# EAGLE design cinamin (EAGLE 6.6.0)
AUTHOR: Joshua Adkins; REV: A; REVISION: A
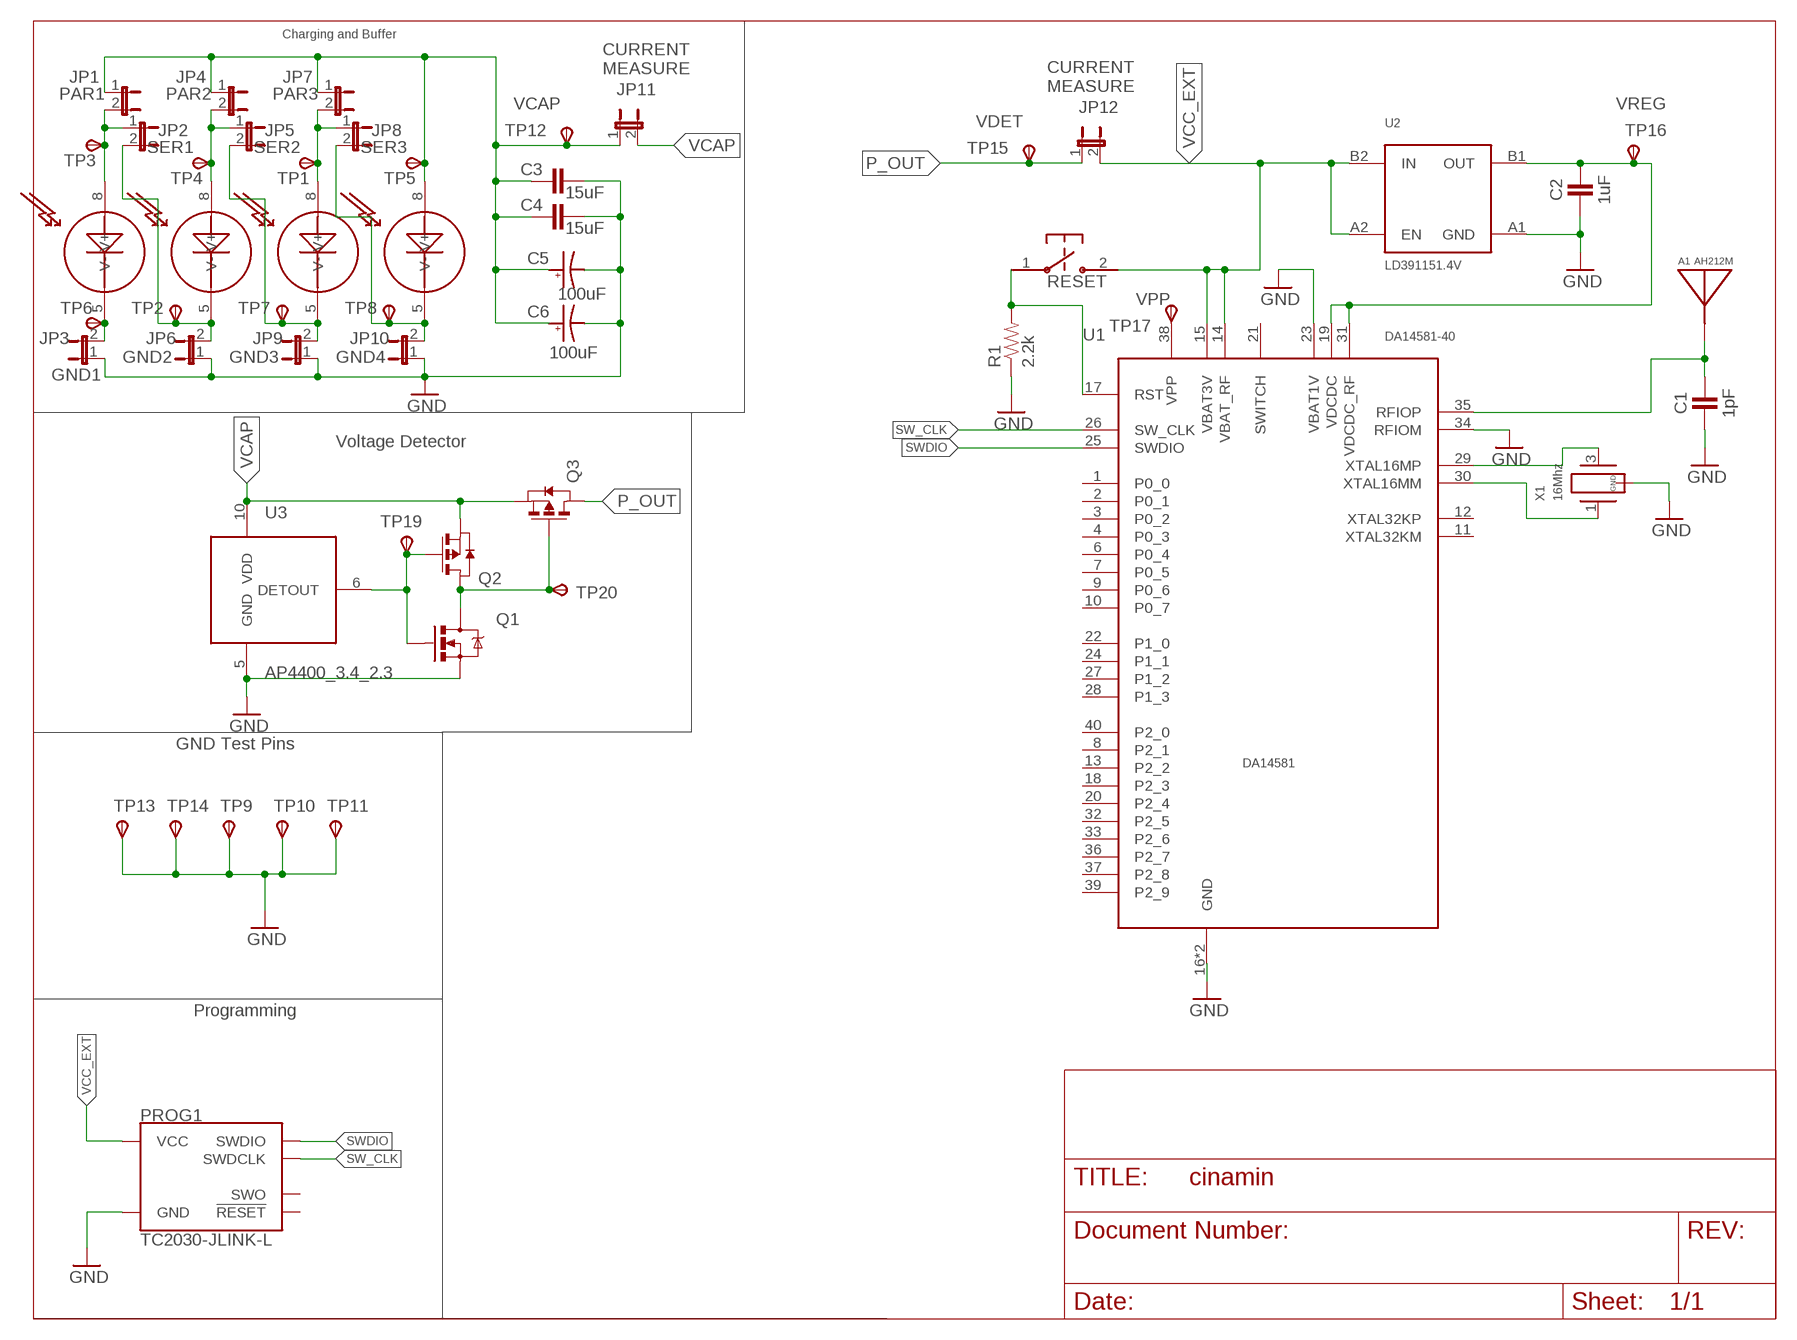
[diagram p0: schematic, sheet 1]

## Parts
A1  AH212M  [AH212M]
C1  1pF  CAPACITOR  [0402_CAP]
C2  1uF  CAPACITOR  [0402_CAP]
C3  15uF  CAPACITOR  [0402_CAP]
C4  15uF  CAPACITOR  [0402_CAP]
C5  100uF  CAP_POL0603  [CAP0603]
C6  100uF  CAP_POL0603  [CAP0603]
D1  CPC1822  [SOIC-8]
D2  CPC1822  [SOIC-8]
D3  CPC1822  [SOIC-8]
D4  CPC1822  [SOIC-8]
JP1  PAR1  JUMPER-2PTH  [1X02]
JP2  SER1  JUMPER-2PTH  [1X02]
JP3  GND1  JUMPER-2PTH  [1X02]
JP4  PAR2  JUMPER-2PTH  [1X02]
JP5  SER2  JUMPER-2PTH  [1X02]
JP6  GND2  JUMPER-2PTH  [1X02]
JP7  PAR3  JUMPER-2PTH  [1X02]
JP8  SER3  JUMPER-2PTH  [1X02]
JP9  GND3  JUMPER-2PTH  [1X02]
JP10  GND4  JUMPER-2PTH  [1X02]
JP11  CURRENT_MEASURE1  JUMPER-2PTH  [1X02]
JP12  CURRENT_MEASURE2  JUMPER-2PTH  [1X02]
PROG1  TC2030-JLINK-L  [TC2030-IDC]
Q1  MOSFET-NCHANNELXFDN-3  [XFDFN-3]
Q2  MOSFET-PCHANNEL  [XFDFN-3]
Q3  MOSFET-PCHANNEL  [XFDFN-3]
R1  2.2k  RESISTOR0402_RES  [0402_RES]
RESET  B3U-1000P  [B3U-1000P]
TP1  D3H  TPSPAD1-13  [P1-13]
TP2  D2L  TPSPAD1-13  [P1-13]
TP3  D1H  TPSPAD1-13  [P1-13]
TP4  D2H  TPSPAD1-13  [P1-13]
TP5  D4H  TPSPAD1-13  [P1-13]
TP6  D1L  TPSPAD1-13  [P1-13]
TP7  D3L  TPSPAD1-13  [P1-13]
TP8  D4L  TPSPAD1-13  [P1-13]
TP9  GND  TPSPAD1-13  [P1-13]
TP10  GND  TPSPAD1-13  [P1-13]
TP11  GND  TPSPAD1-13  [P1-13]
TP12  VCAP  TPSPAD1-13  [P1-13]
TP13  GND  TPSPAD1-13  [P1-13]
TP14  GND  TPSPAD1-13  [P1-13]
TP15  VDET  TPSPAD1-13  [P1-13]
TP16  VREG  TPSPAD1-13  [P1-13]
TP17  VPP  TPSPAD1-13  [P1-13]
TP19  VCAP  TPSPAD1-13  [P1-13]
TP20  VCAP  TPSPAD1-13  [P1-13]
U1  DA14581-40  [QFN-40-5MM]
U2  LD391151.4V  [FLIP_CHIP-4]
U3  AP4400_3.4_2.3  AP4400  [TSOP-10]
X1  16Mhz  TXC-8Y  [TXC-8Y]

## Nets
DET_OUT: Q1.G Q2.G TP19.TP(PP) U3.6(DETOUT)
GND: C1.2 C2.2 C3.2 C4.2 C5.NEG(ANODE) C6.NEG(ANODE) JP3.1 JP6.1 JP9.1 JP10.1 PROG1.5(GND) Q1.S R1.1 TP9.TP(PP) TP10.TP(PP) TP11.TP(PP) TP13.TP(PP) TP14.TP(PP) U1.16(GND) U1.23(VBAT1V) U1.34(RFIOM) U1.PAD(GND) U2.A1(GND) U3.5(GND) X1.2(GND) X1.4(GND)
JP10: D4.5(V-) JP8.2 JP10.2 TP8.TP(PP)
N$1: C3.1 C4.1 C5.POS(CATHODE) C6.POS(CATHODE) D4.8(V+) JP1.1 JP4.1 JP7.1 JP11.1 TP5.TP(PP) TP12.TP(PP)
N$2: TP17.TP(PP) U1.38(VPP)
N$3: C2.1 TP16.TP(PP) U1.19(VDCDC) U1.31(VDCDC_RF) U2.B1(OUT)
N$4: Q1.D Q2.D Q3.G TP20.TP(PP)
N$15: U1.29(XTAL16MP) X1.3
N$18: U1.30(XTAL16MM) X1.1
N$19: A1.P1(ANTENNA) C1.1 U1.35(RFIOP)
N$22: R1.2 RESET.1 U1.17(RST)
N$61: D1.5(V-) JP3.2 TP6.TP(PP)
N$62: D2.5(V-) JP2.2 JP6.2 TP2.TP(PP)
N$63: D3.5(V-) JP5.2 JP9.2 TP7.TP(PP)
N$65: D1.8(V+) JP1.2 JP2.1 TP3.TP(PP)
N$67: D2.8(V+) JP4.2 JP5.1 TP4.TP(PP)
N$68: D3.8(V+) JP7.2 JP8.1 TP1.TP(PP)
P_OUT: JP12.1 Q3.D TP15.TP(PP)
SW_CLK: PROG1.4(SWDCLK) U1.26(SW_CLK)
SWDIO: PROG1.2(SWDIO) U1.25(SWDIO)
VCAP: JP11.2 Q2.S Q3.S U3.10(VDD)
VCC_EXT: JP12.2 PROG1.1(VCC) RESET.2 U1.14(VBAT_RF) U1.15(VBAT3V) U2.A2(EN) U2.B2(IN)
Unconnected: PROG1.3(!RESET) PROG1.6(SWO) U1.1(P0_0) U1.2(P0_1) U1.3(P0_2) U1.4(P0_3) U1.6(P0_4) U1.7(P0_5) U1.8(P2_1) U1.9(P0_6) U1.10(P0_7) U1.11(XTAL32KM) U1.12(XTAL32KP) U1.13(P2_2) U1.18(P2_3) U1.20(P2_4) U1.21(SWITCH) U1.22(P1_0) U1.24(P1_1) U1.27(P1_2) U1.28(P1_3) U1.32(P2_5) U1.33(P2_6) U1.36(P2_7) U1.37(P2_8) U1.39(P2_9) U1.40(P2_0)

## Notes on the sheet
- Charging and Buffer
- CURRENT
  MEASURE
- CURRENT
  MEASURE
- VCAP | VREG
- VDET
- VPP
- Voltage Detector
- GND Test Pins
- Programming

## Library data of the parts
A1 = chips:AH212M: Small 2.4Ghz chip antenna; DIGIKEY: 587-2725-1-ND
C1-C4 = passives:CAPACITOR: 0402 Capacitor
C5 C6 = passives:CAP_POL
D1-D4 = chips:CPC1822: SOIC Solar Cell; DIGIKEY: CLA289-ND
JP1-JP12 = SparkFun-Passives:JUMPER-2: Jumper Basic 0.1" spaced jumper. Use with breakaway headers.
PROG1 = connector:TC2030-JLINK
Q1 = fets:MOSFET-NCHANNEL: Generic NMOS footprint; DIGIKEY: DMN2400UFB4-7DICT-ND
Q2 Q3 = fets:MOSFET-PCHANNEL: small package Pchannel fet; DIGIKEY: DMP21D5UFB4-7BDICT-ND
R1 = passives:RESISTOR: Resistor Basic schematic elements and footprints for 0603, 1206, and PTH resistors.
RESET = switches:B3U: Switch; DIGIKEY: SW1020CT-ND
TP1-TP17 TP19 TP20 = testpad:TPS: TEST PIN
U1 = chips:DA14581-40: A better version of the DA14580 - faster boot; DIGIKEY: 1564-1016-1-ND
U2 = chips:LD39115: Small, low current LDO STMICRO; DIGIKEY: 497-15591-2-ND
U3 = chips:AP4400: Ultra Low Power Voltage Detector with Hysterisis; DIGIKEY: CANT_BUY
X1 = crystals:TXC-8Y: 2mmx1.6mm SMD Crystal

## Board
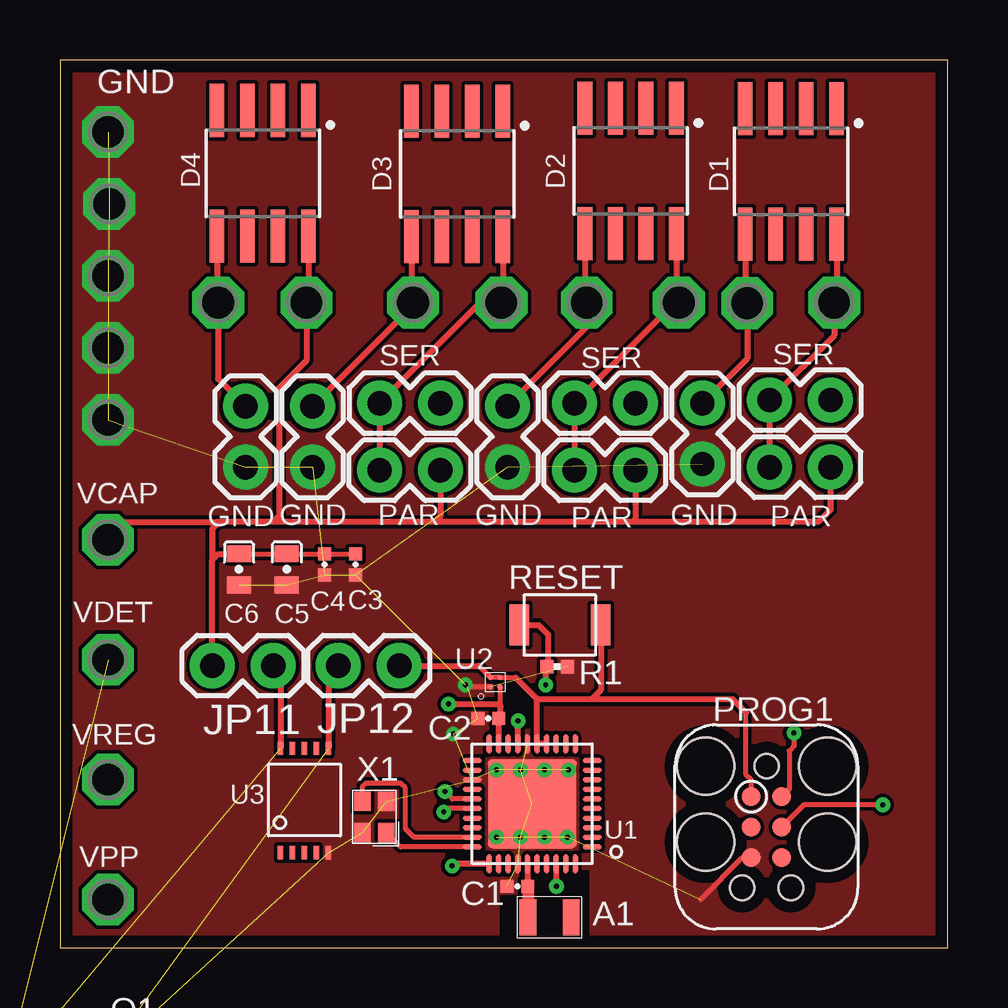
[diagram p1: board, top side]
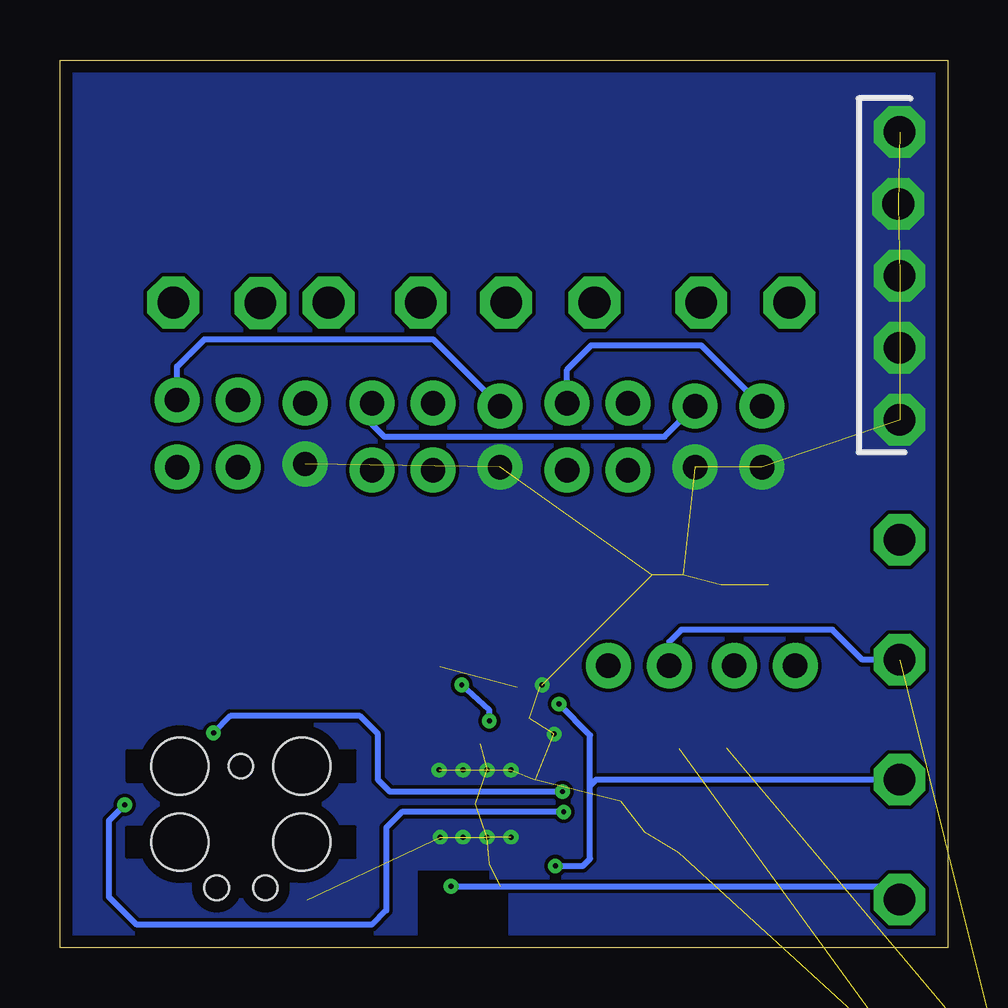
[diagram p2: board, bottom side, seen from below]

Size 37 x 37 mm. Coordinates in mm from the lower left corner, seen from the top.
Outline: 0,0 37,0 37,37 0,37 0,0
Copper layers (1*16): Top 0.0178mm / dielectric 59mil / Bottom 0.0178mm
Design rules "sunstone-2lyr_v1.0.0.3": minimum track width 6mil, minimum drill 14mil, track to track 6mil, track to pad 6mil, pad to pad 6mil, via to via 6mil, smd to smd 6mil, copper to edge 20mil, drill to drill 16mil, minimum pad ring 8mil, minimum via ring 8mil, stop-mask expansion 3mil, vias tented up to drill 50mil, thermal gap 10mil

### Footprints (pad centres in the part's own frame; a part is rotated, then mirrored left to right if it is on the bottom)
AH212M = smd 1.5 x 0.7: P1 0,0.35; P2 0,2.15
0402_CAP = smd 0.536 x 0.546: 1 -0.433,0; 2 0.433,0
CAP0603 = smd 0.7 x 1: NEG 0.65,0; POS -0.65,0
SOIC-8 = smd 0.61 x 2.21: 1 -1.905,-2.616; 2 -0.635,-2.616; 3 0.635,-2.616; 4 1.905,-2.616; 5 1.905,2.616; 6 0.635,2.616; 7 -0.635,2.616; 8 -1.905,2.616
1X02 = drill 1.016 pad 1.88: 1 0,0; 2 2.54,0
TC2030-IDC = smd 0.787 x 0.787: 1 -1.27,-0.635; 2 -1.27,0.635; 3 0,-0.635; 4 0,0.635; 5 1.27,-0.635; 6 1.27,0.635 | hole 2.375: -2.54,2.54; 0.635,2.54; 0.635,-2.54; -2.54,-2.54 | hole 1.016: -2.54,0; 2.54,1.016; 2.54,-1.016
XFDFN-3 = smd 0.4 x 0.7: D 0.35,0 | smd 0.4 x 0.25: G -0.35,0.215; S -0.35,-0.215
0402_RES = smd 0.536 x 0.546: 1 -0.433,0; 2 0.433,0
B3U-1000P = smd 0.8 x 1.7: 1 -1.7,0; 2 1.7,0
P1-13 = drill 1.321 pad 2.159 octagon: TP 0,0
QFN-40-5MM = smd 0.8 x 0.2: 1 -2.5,1.8; 2 -2.5,1.4; 3 -2.5,1; 4 -2.5,0.6; 5 -2.5,0.2; 6 -2.5,-0.2; 7 -2.5,-0.6; 8 -2.5,-1; 9 -2.5,-1.4; 10 -2.5,-1.8; 21 2.5,-1.8; 22 2.5,-1.4; 23 2.5,-1; 24 2.5,-0.6; 25 2.5,-0.2; 26 2.5,0.2; 27 2.5,0.6; 28 2.5,1; 29 2.5,1.4; 30 2.5,1.8 | smd 0.2 x 0.8: 11 -1.8,-2.5; 12 -1.4,-2.5; 13 -1,-2.5; 14 -0.6,-2.5; 15 -0.2,-2.5; 16 0.2,-2.5; 17 0.6,-2.5; 18 1,-2.5; 19 1.4,-2.5; 20 1.8,-2.5; 31 1.8,2.5; 32 1.4,2.5; 33 1,2.5; 34 0.6,2.5; 35 0.2,2.5; 36 -0.2,2.5; 37 -0.6,2.5; 38 -1,2.5; 39 -1.4,2.5; 40 -1.8,2.5 | smd 3.7 x 3.7: PAD 0,0
FLIP_CHIP-4 = smd 0.22 x 0.22: A1 -0.2,-0.2; A2 -0.2,0.2; B1 0.2,-0.2; B2 0.2,0.2
TSOP-10 = smd 0.22 x 0.55: 1 -1,-2.2; 2 -0.5,-2.2; 3 0,-2.2; 4 0.5,-2.2; 5 1,-2.2; 6 1,2.15; 7 0.5,2.15; 8 0,2.15; 9 -0.5,2.15; 10 -1,2.15
TXC-8Y = smd 0.8 x 0.7: 1 -0.65,-0.5; 2 0.65,-0.5; 3 0.65,0.5; 4 -0.65,0.5

### Placement (x,y rotation side)
A1  19.16,1.26 270 top
C1  19.07,2.55 180 top
C2  17.86,9.55 180 top
C3  12.32,15.97 270 top
C4  11.04,15.97 270 top
C5  9.46,15.77 270 top
C6  7.46,15.77 270 top
D1  30.47,32.36 180 top
D2  23.79,32.37 180 top
D3  16.56,32.25 180 top
D4  8.45,32.28 180 top
JP1  32.12,20.03 180 top
JP2  29.58,22.82 0 top
JP3  26.78,20.16 90 top
JP4  23.99,19.9 180 top
JP5  21.45,22.7 0 top
JP6  18.66,20.03 90 top
JP7  15.86,19.9 180 top
JP8  13.32,22.7 0 top
JP9  10.53,20.03 90 top
JP10  7.73,20.03 90 top
JP11  6.35,11.75 0 top
JP12  11.6,11.75 0 top
PROG1  29.45,5.03 270 top
Q1  3.05,-3.6 0 top  (outside the outline)
Q2  -3.95,-7.5 0 top  (outside the outline)
Q3  -3.95,-10.4 0 top  (outside the outline)
R1  20.73,11.71 180 top
RESET  20.84,13.44 0 top
TP1  18.4,26.89 0 top
TP2  21.96,26.89 0 top
TP3  32.27,26.89 0 top
TP4  25.8,26.88 0 top
TP5  10.27,26.89 0 top
TP6  28.65,26.86 0 top
TP7  14.72,26.89 0 top
TP8  6.59,26.89 0 top
TP9  2,28 0 top
TP10  2.05,31 0 top
TP11  2,34 0 top
TP12  2,17 0 top
TP13  2,25 0 top
TP14  2,22 0 top
TP15  2,12 0 top
TP16  2,7 0 top
TP17  2,2 0 top
TP19  -5.3,-18.55 0 top  (outside the outline)
TP20  -5.3,-22.7 0 top  (outside the outline)
U1  19.69,5.99 180 top
U2  18.15,11.06 0 top
U3  10.19,6.16 0 top
X1  13.11,5.44 90 top

### Tracks (layer width: path | path; a pad name or v marks a point on that pad's centre or on a via)
DET_OUT  (3 unrouted)
  Top 0.254: 11.19,11.34 U3.6
GND  (via drill 0.2 pad 0.61)  (34 unrouted)
  Top 0.203: PROG1.5 28.46,3.76 26.7,2 | U2.A1 16.99,10.86
  Top 0.254: 16.99,10.86 v16.9,10.95
  other vias: 16.4,8.9 18.2,7.4 19.2,7.4 20.2,7.4 21.2,7.4 18.2,4.6 19.2,4.6 20.2,4.6 21.15,4.6
  pour Top (no thermals): 0,0 0.05,0 0,37 37,37 37,0 22.2,0 22.2,3.35 19,3.35 19,2.3 18.2,2.3 18.2,0 0,-0.05
  pour Bottom (no thermals): 0,0 0.05,0 0,37 37,37 37,0 22.2,0 22.2,3.35 19,3.35 19,2.3 18.2,2.3 18.2,0 0,-0.05
JP10
  Top 0.254: D4.5 6.55,26.93 TP8.TP 6.59,23.71 JP10.2
  Bottom 0.254: JP8.2 15.86,24.09 14.85,25.11 10.27,25.11 JP10.2
N$1
  Top 0.203: C6.POS C5.POS 11.02,16.42 C4.1 C3.1
  Top 0.254: JP1.1 32.12,18.25 31.61,17.74 23.86,17.74 | 23.86,17.74 15.61,17.74 | 15.61,17.74 8.88,17.74 | JP4.1 23.99,17.87 23.86,17.74 | JP7.1 15.86,18 15.61,17.74 | D4.8 10.36,26.97 TP5.TP 10.27,24.47 9.13,23.33 9.13,18 8.88,17.74 | JP11.1 6.35,16.15 | 6.35,16.15 6.6,16.4 7.45,16.4 C6.POS | 8.88,17.74 6.8,17.74 | 6.8,17.74 6.64,17.74 6.35,17.45 6.35,16.15 | TP12.TP 2,17.05 2.65,17.75 6.54,17.75 6.8,17.74
N$2  (via drill 0.2 pad 0.61)
  Top 0.254: U1.38 20.69,2.74 v20.7,2.55
  Bottom 0.254: v20.7,2.55 2.55,2.55 TP17.TP
N$3  (via drill 0.2 pad 0.61)
  Top 0.203: 18.37,10.05 18.37,10.84 U2.B1
  Top 0.254: U1.19 C2.1 18.37,9.63 18.37,10.05 18.27,10.15 v16.2,10.15 | U1.31 16.44,3.49 v16.35,3.4
  Bottom 0.254: v16.35,3.4 15.2,3.4 14.9,3.7 14.9,6.75 | 14.9,6.75 14.9,8.85 v16.2,10.15 | TP16.TP 14.65,7 14.9,6.75
N$4  (3 unrouted)
N$15
  Top 0.203: U1.29 14.76,4.59 14.4,4.95 14.4,6.65 14.2,6.85 12.75,6.85 12.6,6.7 X1.3
  Top 0.254: 12.54,5.83 X1.3
N$18
  Top 0.203: U1.30 14.2,4.19 X1.1
  Top 0.254: 13.71,4.69 X1.1
N$19
  Top 0.254: U1.35 19.49,2.57 C1.1 | 19.5,1.22 A1.P1
  Top 0.508: C1.1 19.5,1.22
N$22  (via drill 0.2 pad 0.61)
  Top 0.254: RESET.1 19.96,13.44 20.35,13.05 20.35,11.76 R1.2 20.25,11.66 v20.25,10.95 | U1.17 19.09,9.44 v19.1,9.45
  Bottom 0.254: v19.1,9.45 19.1,9.9 v20.25,10.95
N$61
  Top 0.254: D1.5 28.57,26.94 TP6.TP 28.65,24.56 JP3.2
N$62
  Top 0.254: D2.5 21.89,26.96 TP2.TP 21.96,25.87 JP6.2
  Bottom 0.254: JP2.2 32.12,24.22 30.97,25.36 21.45,25.36 JP6.2
N$63
  Top 0.254: D3.5 14.65,26.95 TP7.TP 14.72,26.76 JP9.2
  Bottom 0.254: JP5.2 23.99,21.81 23.48,21.3 11.8,21.3 JP9.2
N$65
  Top 0.254: JP1.2 JP2.1 32.27,25.52 TP3.TP 32.38,26.99 D1.8
N$67
  Top 0.254: JP4.2 JP5.1 25.64,26.88 TP4.TP 25.7,26.98 D2.8
N$68
  Top 0.254: JP7.2 JP8.1 17.51,26.89 TP1.TP 18.46,26.95 D3.8
P_OUT  (1 unrouted)
  Bottom 0.254: TP15.TP 3.55,12 4.8,13.25 11.1,13.25 11.6,12.75 JP12.1
SW_CLK  (via drill 0.2 pad 0.61)
  Top 0.203: U1.26 16.14,5.79 v16,5.65 | v34.3,5.95 31.01,5.95 PROG1.4
  Bottom 0.254: v16,5.65 22.75,5.65 23.4,5 23.4,1.55 24,0.95 33.8,0.95 34.95,2.1 34.95,5.3 v34.3,5.95
SWDIO  (via drill 0.2 pad 0.61)
  Top 0.203: U1.25 16.36,6.19 v16.05,6.5 | v30.6,8.95 30.6,8.4 30.4,8.2 30.4,6.61 PROG1.2
  Bottom 0.254: v16.05,6.5 23.25,6.5 23.75,7 23.75,8.9 24.5,9.65 29.9,9.65 v30.6,8.95
VCAP  (2 unrouted)
  Top 0.254: JP11.2 9.19,11.45 U3.10
VCC_EXT
  Top 0.203: U2.A2 U2.B2 19,11.25 | 17.93,11.25 U2.A2 | PROG1.1 28.82,6.98 28.6,7.2 28.6,9.8 | 17.46,11.75 U2.A2
  Top 0.254: U1.14 U1.15 19.89,10.36 | 19.89,10.36 19,11.25 | RESET.2 22.54,10.74 22.15,10.35 | 22.15,10.35 19.9,10.35 19.89,10.36 | 28.6,9.8 28.05,10.35 22.15,10.35 | JP12.2 17.46,11.75

### Text on the board
tNames: GND | SER | SER | SER | VCAP | GND | GND | PAR | GND | PAR | GND | PAR | VDET | U2 | VREG | VPP
tDocu: Cinamin Beacon / Evaluation Board / Rev_B / Joshua Adkins / 05/2016